# Altium schematic sheet altiumDesignerSchematic.schdoc
size 429 x 307 mm
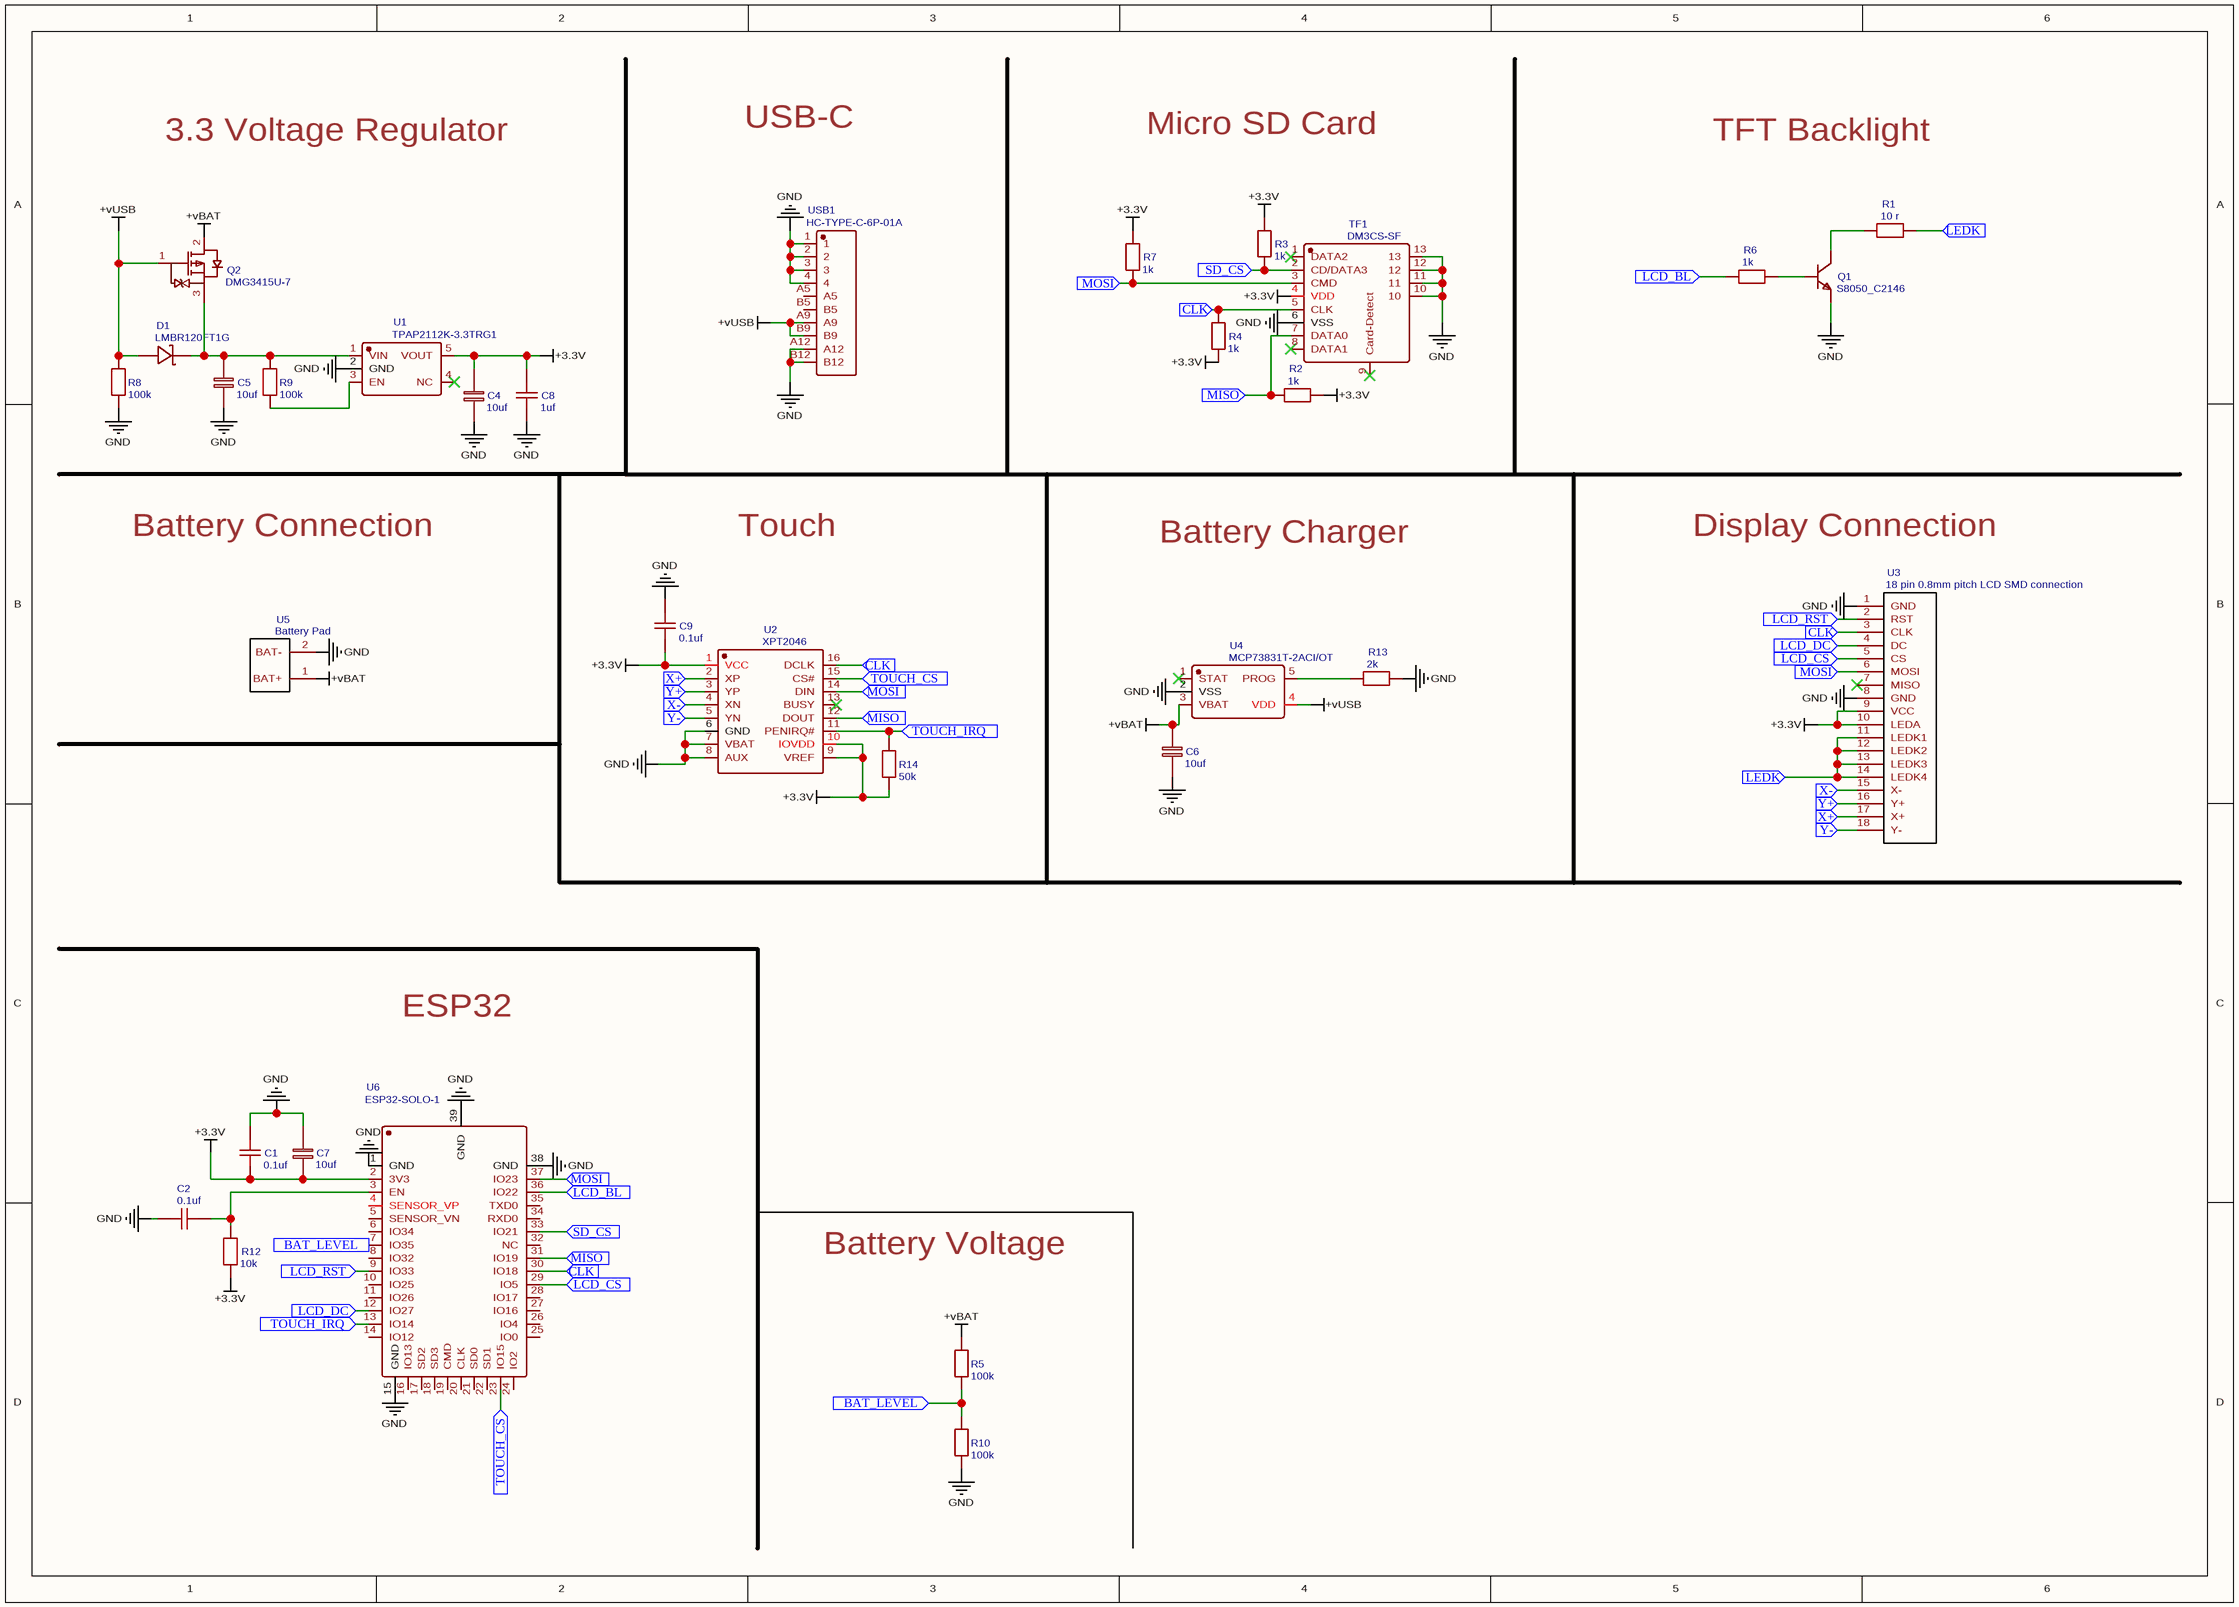
[diagram p0: altiumDesignerSchematic.schdoc]

## Parts
C1  0.1uf  [C0805]
C2  0.1uf  [C0805]
C4  10uf  [C0603]
C5  10uf  [C0603]
C6  10uf  [C0603]
C7  10uf  [C0603]
C8  1uf  [C0603]
C9  0.1uf  [C0805]
D1  LMBR120FT1G  [SOD-123_L2.8-W1.8-LS3.7-RD]
Q1  S8050_C2146  [SOT-23-3_L3.0-W1.7-P0.95-LS2.9-BR]
Q2  DMG3415U-7  [SOT-23-3_L2.9-W1.6-P1.90-LS2.8-BR-CW]
R1  10 r  [R0603]
R2  1k  [R0603]
R3  1k  [R0603]
R4  1k  [R0603]
R5  100k  [R0603]
R6  1k  [R0603]
R7  1k  [R0603]
R8  100k  [R0603]
R9  100k  [R0603]
R10  100k  [R0603]
R12  10k  [R0603]
R13  2k  [R0603]
R14  50k  [R0603]
TF1  DM3CS-SF  [TF-SMD_DM3CS-SF]
U1  TPAP2112K-3.3TRG1  [SOT-23-5_L2.9-W1.6-P0.95-LS2.8-BR]
U2  XPT2046  [TSSOP-16_L5.0-W4.4-P0.65-LS6.4-BL]
U3  18 pin 0.8mm pitch LCD SMD connection  [SMD TFT 18PIN 0.8MM]
U4  MCP73831T-2ACI/OT  [SOT-23-5_L3.0-W1.7-P0.95-LS2.8-BR]
U5  Battery Pad  [BATTERY_PAD]
U6  ESP32-SOLO-1  [WIFIM-SMD_38P-L25.5-W18.0-P1.27]
USB1  HC-TYPE-C-6P-01A  [USB-C-SMD_HC-TYPE-C-6P-01A]

## Ports
BAT_LEVEL (in), CLK (in), LCD_BL (in), LCD_CS (in), LCD_DC (in), LCD_RST (in), LEDK (in), MISO (in), MOSI (in), SD_CS (in), TOUCH_CS (in), TOUCH_IRQ (in), X+ (in), X- (in), Y+ (in), Y- (in)

## Nets
+3.3V: C1.1 C4.2 C7.1 C8.2 C9.1 R2.2 R3.2 R4.1 R7.2 R12.1 R14.1 TF1.4(VDD) U1.5(VOUT) U2.1(VCC) U2.9(VREF) U2.10(IOVDD) U3.9(VCC) U3.10(LEDA) U6.2(3V3)
+vBAT: C6.2 Q2.2(D) R5.2 U4.3(VBAT) U5.1(BAT+)
+vUSB: D1.2(A) Q2.1(G) R8.2 U4.4(VDD) USB1.A9 USB1.B9
GND: C1.2 C2.2 C4.1 C5.1 C6.1 C7.2 C8.1 C9.2 Q1.2(E) R8.1 R10.1 R13.2 TF1.6(VSS) TF1.10 TF1.11 TF1.12 TF1.13 U1.2(GND) U2.6(GND) U2.7(VBAT) U2.8(AUX) U3.1(GND) U3.8(GND) U4.2(VSS) U5.2(BAT-) U6.1(GND) U6.15(GND) U6.38(GND) U6.39(GND) USB1.1 USB1.2 USB1.3 USB1.4 USB1.A12 USB1.B12
BAT_LEVEL: R5.1 R10.2 U6.7(IO35) ; port BAT_LEVEL
CLK: R4.2 TF1.5(CLK) U2.16(DCLK) U3.3(CLK) U6.30(IO18) ; port CLK
LCD_BL: R6.1 U6.36(IO22) ; port LCD_BL
LCD_CS: U3.5(CS) U6.29(IO5) ; port LCD_CS
LCD_DC: U3.4(DC) U6.12(IO27) ; port LCD_DC
LCD_RST: U3.2(RST) U6.9(IO33) ; port LCD_RST
LEDK: R1.2 U3.11(LEDK1) U3.12(LEDK2) U3.13(LEDK3) U3.14(LEDK4) ; port LEDK
MISO: R2.1 TF1.7(DATA0) U2.12(DOUT) U6.31(IO19) ; port MISO
MOSI: R7.1 TF1.3(CMD) U2.14(DIN) U3.6(MOSI) U6.37(IO23) ; port MOSI
SD_CS: R3.1 TF1.2(CD/DATA3) U6.33(IO21) ; port SD_CS
TOUCH_CS: U2.15(CS#) U6.23(IO15) ; port TOUCH_CS
TOUCH_IRQ: R14.2 U2.11(PENIRQ#) U6.13(IO14) ; port TOUCH_IRQ
X+: U2.2(XP) U3.17(X+) ; port X+
X-: U2.4(XN) U3.15(X-) ; port X-
Y+: U2.3(YP) U3.16(Y+) ; port Y+
Y-: U2.5(YN) U3.18(Y-) ; port Y-
NetC2_1: C2.1 R12.2 U6.3(EN)
NetC5_2: C5.2 D1.1(K) Q2.3(S) R9.2 U1.1(VIN)
NetQ1_1: Q1.1(B) R6.2
NetQ1_3: Q1.3(C) R1.1
NetR9_1: R9.1 U1.3(EN)
NetR13_1: R13.1 U4.5(PROG)

Not connected (* = marked no-connect by the designer): TF1 1(DATA2)* 8(DATA1)* 9(Card-Detect)*; U1 4(NC)*; U2 13(BUSY)*; U3 7(MISO)*; U4 1(STAT)*; U6 4(SENSOR_VP) 5(SENSOR_VN) 6(IO34) 8(IO32) 10(IO25) 11(IO26) 14(IO12) 16(IO13) 17(SD2) 18(SD3) 19(CMD) 20(CLK) 21(SD0) 22(SD1) 24(IO2) 25(IO0) 26(IO4) 27(IO16) 28(IO17) 32(NC) 34(RXD0) 35(TXD0); USB1 A5 B5

## Notes on the sheet
- 3.3 Voltage Regulator
- USB-C
- Micro SD Card
- TFT Backlight
- Battery Connection
- Touch
- Battery Charger
- Display Connection
- ESP32
- Battery Voltage

## Library data of the parts
C1 C2 C9 = 0.1uf: nameAlias: Value(F); Contributor: LCEDA_Lib; spicePre: C; spiceSymbolName: C_0805_US
C4-C7 = 10uf: nameAlias: Value(F); Contributor: LCEDA_Lib; spicePre: C; spiceSymbolName: C_0603_EU
C8 = 1uf: nameAlias: Value(F); Contributor: LCEDA_Lib; spicePre: C; spiceSymbolName: C_0603_US
D1 = LMBR120FT1G: BOM_Manufacturer: LRC(乐山无线电); BOM_Supplier: LCSC; BOM_Manufacturer Part: LMBR120FT1G; BOM_Supplier Part: C81143; BOM_JLCPCB Part Class: Extended Part; spicePre: D; spiceSymbolName: LMBR120FT1G
Q1 = S8050_C2146: BOM_Manufacturer: CJ(江苏长电/长晶); BOM_Manufacturer Part: S8050 J3Y; BOM_Supplier: LCSC; BOM_Supplier Part: C2146; BOM_JLCPCB Part Class: Basic Part; spicePre: Q; spiceSymbolName: S8050_C2146
Q2 = DMG3415U-7: BOM_Manufacturer: Diodes Incorporated; Contributor: LCSC; BOM_Supplier: LCSC; BOM_Supplier Part: C96616; BOM_Manufacturer Part: DMG3415U-7; BOM_JLCPCB Part Class: Extended Part; spicePre: Q; spiceSymbolName: DMG3415U-7
R1 = 10 r: nameAlias: Value(Ω); Contributor: LCEDA_Lib; spicePre: R; spiceSymbolName: R_0603_EU
R2-R4 R6 R7 = 1k: nameAlias: Value(Ω); Contributor: LCEDA_Lib; spicePre: R; spiceSymbolName: R_0603_EU
R5 R8-R10 = 100k: nameAlias: Value(Ω); Contributor: LCEDA_Lib; spicePre: R; spiceSymbolName: R_0603_EU
R12 = 10k: nameAlias: Value(Ω); Contributor: LCEDA_Lib; spicePre: R; spiceSymbolName: R_0603_EU
R13 = 2k: nameAlias: Value(Ω); Contributor: LCEDA_Lib; spicePre: R; spiceSymbolName: R_0603_EU
R14 = 50k: nameAlias: Value(Ω); Contributor: LCEDA_Lib; spicePre: R; spiceSymbolName: R_0603_EU
TF1 = DM3CS-SF: BOM_Manufacturer: Hirose; Contributor: LCSC; BOM_Supplier: LCSC; BOM_Supplier Part: C202111; BOM_Manufacturer Part: DM3CS-SF; BOM_JLCPCB Part Class: Extended Part; spicePre: T; spiceSymbolName: DM3CS-SF
U1 = TPAP2112K-3.3TRG1: BOM_Manufacturer: TECH PUBLIC(台舟); Contributor: lcsc; BOM_Supplier: LCSC; BOM_Supplier Part: C3021085; BOM_Manufacturer Part: TPAP2112K-3.3TRG1; link: https://atta.szlcsc.com/upload/public/pdf/source/20220524/8CF0233C3A5BEC2862946B9116FD2D75.pdf; BOM_JLCPCB Part Class: Extended Part; spicePre: U; spiceSymbolName: TPAP2112K-3.3TRG1
U2 = XPT2046: BOM_Manufacturer: XPT(矽普特); BOM_Supplier: LCSC; BOM_Manufacturer Part: XPT2046; BOM_Supplier Part: C19076; BOM_JLCPCB Part Class: Extended Part; spicePre: U; spiceSymbolName: XPT2046
U3 = 18 pin 0.8mm pitch LCD SMD connection: BOM_Manufacturer Part: spi tft screen generic 0.8mm pitch smd; Contributor: Jason Lashchuk; spicePre: U; spiceSymbolName: 18 pin 0.8mm pitch LCD SMD connection
U4 = MCP73831T-2ACI/OT: BOM_Manufacturer: Microchip Tech; Contributor: LCSC; BOM_Supplier: LCSC; BOM_Supplier Part: C424093; BOM_Manufacturer Part: MCP73831T-2ACI/OT; BOM_JLCPCB Part Class: Extended Part; spicePre: U; spiceSymbolName: MCP73831T-2ACI/OT
U5 = Battery Pad: Contributor: AshleeJ; spicePre: U; spiceSymbolName: Battery Pad
U6 = ESP32-SOLO-1: BOM_Manufacturer: ESPRESSIF(乐鑫); Contributor: LCSC; BOM_Supplier: LCSC; BOM_Supplier Part: C473005; BOM_Manufacturer Part: ESP32-SOLO-1; BOM_JLCPCB Part Class: Extended Part; spicePre: U; spiceSymbolName: ESP32-SOLO-1
USB1 = HC-TYPE-C-6P-01A: BOM_Manufacturer: HCTL(华灿天禄); Contributor: LCSC; BOM_Supplier: LCSC; BOM_Supplier Part: C2894893; BOM_Manufacturer Part: HC-TYPE-C-6P-01A; BOM_JLCPCB Part Class: Extended Part; spicePre: U; spiceSymbolName: HC-TYPE-C-6P-01A